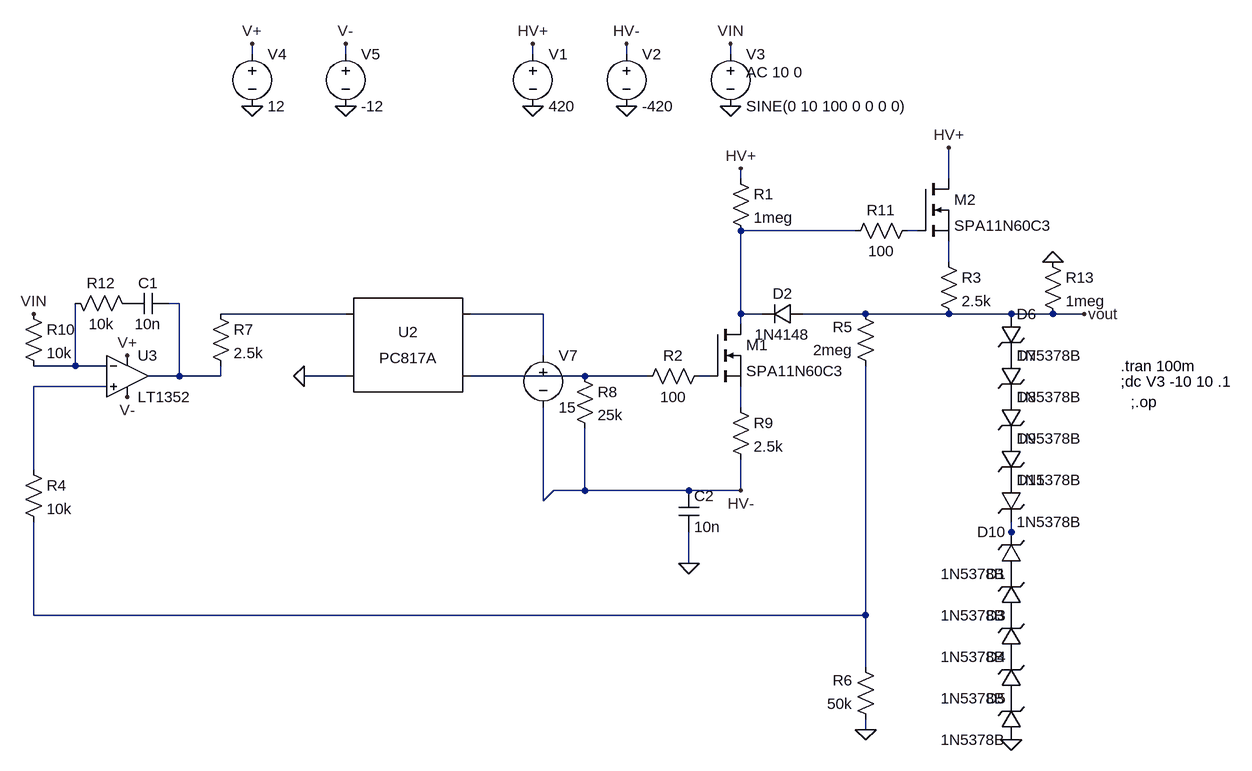
[diagram p0: schematic Draft11degeneration.asc]
Draft11degeneration.asc, the LTspice schematic file:
Version 4
SHEET 1 992 932
WIRE -544 -208 -544 -224
WIRE -400 -208 -400 -224
WIRE -112 -208 -112 -224
WIRE 32 -208 32 -224
WIRE 192 -208 192 -224
WIRE 208 -16 208 -32
WIRE 528 -16 528 -64
WIRE 384 64 208 64
WIRE 480 64 464 64
WIRE 528 112 528 80
WIRE -656 176 -672 176
WIRE -400 192 -592 192
WIRE -96 192 -208 192
WIRE 208 192 208 64
WIRE 240 192 208 192
WIRE 400 192 304 192
WIRE 528 192 400 192
WIRE 624 192 528 192
WIRE 688 192 624 192
WIRE 736 192 688 192
WIRE 208 208 208 192
WIRE -96 256 -96 192
WIRE -816 272 -816 176
WIRE -816 272 -880 272
WIRE -768 272 -816 272
WIRE -656 288 -656 176
WIRE -656 288 -704 288
WIRE -592 288 -592 272
WIRE -592 288 -656 288
WIRE -400 288 -464 288
WIRE -32 288 -208 288
WIRE 64 288 -32 288
WIRE 160 288 144 288
WIRE -768 304 -880 304
WIRE 208 336 208 304
WIRE -880 432 -880 304
WIRE -32 464 -32 368
WIRE -32 464 -80 464
WIRE 128 464 -32 464
WIRE 208 464 208 416
WIRE 208 464 128 464
WIRE -96 480 -96 336
WIRE -96 480 -80 464
WIRE 624 528 624 512
WIRE 624 544 624 528
WIRE 128 576 128 528
WIRE -880 656 -880 512
WIRE 400 656 400 272
WIRE 400 656 -880 656
WIRE 400 736 400 656
WIRE 400 832 400 816
FLAG -112 -128 0
FLAG 32 -128 0
FLAG 192 -128 0
FLAG -112 -224 HV+
FLAG 32 -224 HV-
FLAG 192 -224 VIN
FLAG 208 -32 HV+
FLAG 528 -64 HV+
FLAG -544 -128 0
FLAG -400 -128 0
FLAG -544 -224 V+
FLAG -400 -224 V-
FLAG -736 256 V+
FLAG -736 320 V-
FLAG 128 576 0
FLAG -464 288 0
FLAG 736 192 vout
FLAG 624 848 0
FLAG 400 832 0
FLAG -880 192 VIN
FLAG 208 464 HV-
FLAG 688 112 0
SYMBOL nmos 160 208 R0
SYMATTR InstName M1
SYMATTR Value SPA11N60C3
SYMBOL voltage -112 -224 R0
WINDOW 123 0 0 Left 2
WINDOW 39 0 0 Left 2
SYMATTR InstName V1
SYMATTR Value 420
SYMBOL voltage 32 -224 R0
WINDOW 123 0 0 Left 2
WINDOW 39 0 0 Left 2
SYMATTR InstName V2
SYMATTR Value -420
SYMBOL voltage 192 -224 R0
WINDOW 123 24 44 Left 2
WINDOW 39 0 0 Left 2
SYMATTR Value2 AC 10 0
SYMATTR InstName V3
SYMATTR Value SINE(0 10 100 0 0 0 0)
SYMBOL nmos 480 -16 R0
SYMATTR InstName M2
SYMATTR Value SPA11N60C3
SYMBOL diode 304 176 R90
WINDOW 0 0 32 VBottom 2
WINDOW 3 32 32 VTop 2
SYMATTR InstName D2
SYMATTR Value 1N4148
SYMBOL res 512 96 R0
SYMATTR InstName R3
SYMATTR Value 2.5k
SYMBOL voltage -544 -224 R0
WINDOW 123 0 0 Left 2
WINDOW 39 0 0 Left 2
SYMATTR InstName V4
SYMATTR Value 12
SYMBOL voltage -400 -224 R0
WINDOW 123 0 0 Left 2
WINDOW 39 0 0 Left 2
SYMATTR InstName V5
SYMATTR Value -12
SYMBOL res 416 288 R180
WINDOW 0 36 76 Left 2
WINDOW 3 36 40 Left 2
SYMATTR InstName R5
SYMATTR Value 2meg
SYMBOL res 416 832 R180
WINDOW 0 36 76 Left 2
WINDOW 3 36 40 Left 2
SYMATTR InstName R6
SYMATTR Value 50k
SYMBOL res -48 272 R0
SYMATTR InstName R8
SYMATTR Value 25k
SYMBOL cap 112 464 R0
SYMATTR InstName C2
SYMATTR Value 10n
SYMBOL Optos\\PC817A -304 240 R0
SYMATTR InstName U2
SYMBOL voltage -96 240 R0
WINDOW 123 0 0 Left 2
WINDOW 39 0 0 Left 2
SYMATTR InstName V7
SYMATTR Value 15
SYMBOL res 192 -32 R0
SYMATTR InstName R1
SYMATTR Value 1meg
SYMBOL zener 608 192 R0
SYMATTR InstName D6
SYMATTR Value 1N5378B
SYMATTR Description Diode
SYMATTR Type diode
SYMBOL zener 608 256 R0
SYMATTR InstName D7
SYMATTR Value 1N5378B
SYMATTR Description Diode
SYMATTR Type diode
SYMBOL zener 608 320 R0
SYMATTR InstName D8
SYMATTR Value 1N5378B
SYMATTR Description Diode
SYMATTR Type diode
SYMBOL zener 608 384 R0
SYMATTR InstName D9
SYMATTR Value 1N5378B
SYMATTR Description Diode
SYMATTR Type diode
SYMBOL zener 640 656 R180
WINDOW 0 24 64 Left 2
WINDOW 3 24 0 Left 2
SYMATTR InstName D1
SYMATTR Value 1N5378B
SYMATTR Description Diode
SYMATTR Type diode
SYMBOL zener 640 720 R180
WINDOW 0 24 64 Left 2
WINDOW 3 24 0 Left 2
SYMATTR InstName D3
SYMATTR Value 1N5378B
SYMATTR Description Diode
SYMATTR Type diode
SYMBOL zener 640 784 R180
WINDOW 0 24 64 Left 2
WINDOW 3 24 0 Left 2
SYMATTR InstName D4
SYMATTR Value 1N5378B
SYMATTR Description Diode
SYMATTR Type diode
SYMBOL zener 640 848 R180
WINDOW 0 24 64 Left 2
WINDOW 3 24 0 Left 2
SYMATTR InstName D5
SYMATTR Value 1N5378B
SYMATTR Description Diode
SYMATTR Type diode
SYMBOL zener 640 592 R180
WINDOW 0 24 64 Left 2
WINDOW 3 24 0 Left 2
SYMATTR InstName D10
SYMATTR Value 1N5378B
SYMATTR Description Diode
SYMATTR Type diode
SYMBOL zener 608 448 R0
SYMATTR InstName D11
SYMATTR Value 1N5378B
SYMATTR Description Diode
SYMATTR Type diode
SYMBOL res -608 176 R0
SYMATTR InstName R7
SYMATTR Value 2.5k
SYMBOL res -896 416 R0
SYMATTR InstName R4
SYMATTR Value 10k
SYMBOL res -896 176 R0
SYMATTR InstName R10
SYMATTR Value 10k
SYMBOL res -832 160 M90
WINDOW 0 0 56 VBottom 2
WINDOW 3 32 56 VTop 2
SYMATTR InstName R12
SYMATTR Value 10k
SYMBOL cap -736 160 M90
WINDOW 0 0 32 VBottom 2
WINDOW 3 32 32 VTop 2
SYMATTR InstName C1
SYMATTR Value 10n
SYMBOL Opamps\\LT1352 -736 224 R0
SYMATTR InstName U3
SYMBOL res 160 272 R90
WINDOW 0 0 56 VBottom 2
WINDOW 3 32 56 VTop 2
SYMATTR InstName R2
SYMATTR Value 100
SYMBOL res 480 48 R90
WINDOW 0 0 56 VBottom 2
WINDOW 3 32 56 VTop 2
SYMATTR InstName R11
SYMATTR Value 100
SYMBOL res 192 320 R0
SYMATTR InstName R9
SYMATTR Value 2.5k
SYMBOL res 672 96 R0
SYMATTR InstName R13
SYMATTR Value 1meg
TEXT 792 296 Left 2 !;dc V3 -10 10 .1
TEXT 792 272 Left 2 !.tran 100m
TEXT 808 328 Left 2 !;.op

The netlist it stands for:
* Draft11degeneration.asc
M1 N001 N009 N011 N011 SPA11N60C3
V1 HV+ 0 420
V2 HV- 0 -420
V3 VIN 0 SINE(0 10 100 0 0 0 0) AC 10 0
M2 HV+ N002 N003 N003 SPA11N60C3
D2 vout N001 1N4148
R3 N003 vout 2.5k
V4 V+ 0 12
V5 V- 0 -12
R5 N013 vout 2meg
R6 0 N013 50k
R8 N008 HV- 25k
C2 HV- 0 10n
XU2 N005 0 N006 N008 PC817 Igain=1m
V7 N006 HV- 15
R1 HV+ N001 1meg
D6 vout P001 1N5378B
D7 P001 P002 1N5378B
D8 P002 P003 1N5378B
D9 P003 P004 1N5378B
D1 P005 P006 1N5378B
D3 P007 P005 1N5378B
D4 P008 P007 1N5378B
D5 0 P008 1N5378B
D10 P006 N012 1N5378B
D11 P004 N012 1N5378B
R7 N005 N004 2.5k
R4 N010 N013 10k
R10 VIN N007 10k
R12 N007 P009 10k
C1 P009 N004 10n
XU3 N010 N007 V+ V- N004 LT1352  ; pins In+ In- V+ V- OUT
R2 N009 N008 100
R11 N002 N001 100
R9 N011 HV- 2.5k
R13 0 vout 1meg
.model D D
.lib standard.dio
.model NMOS NMOS
.model PMOS PMOS
.lib standard.mos
;dc V3 -10 10 .1
.tran 100m
;.op
.lib PC817.sub
.lib LTC.lib
.backanno
.end